# Altium schematic sheet LCD.SchDoc
size A
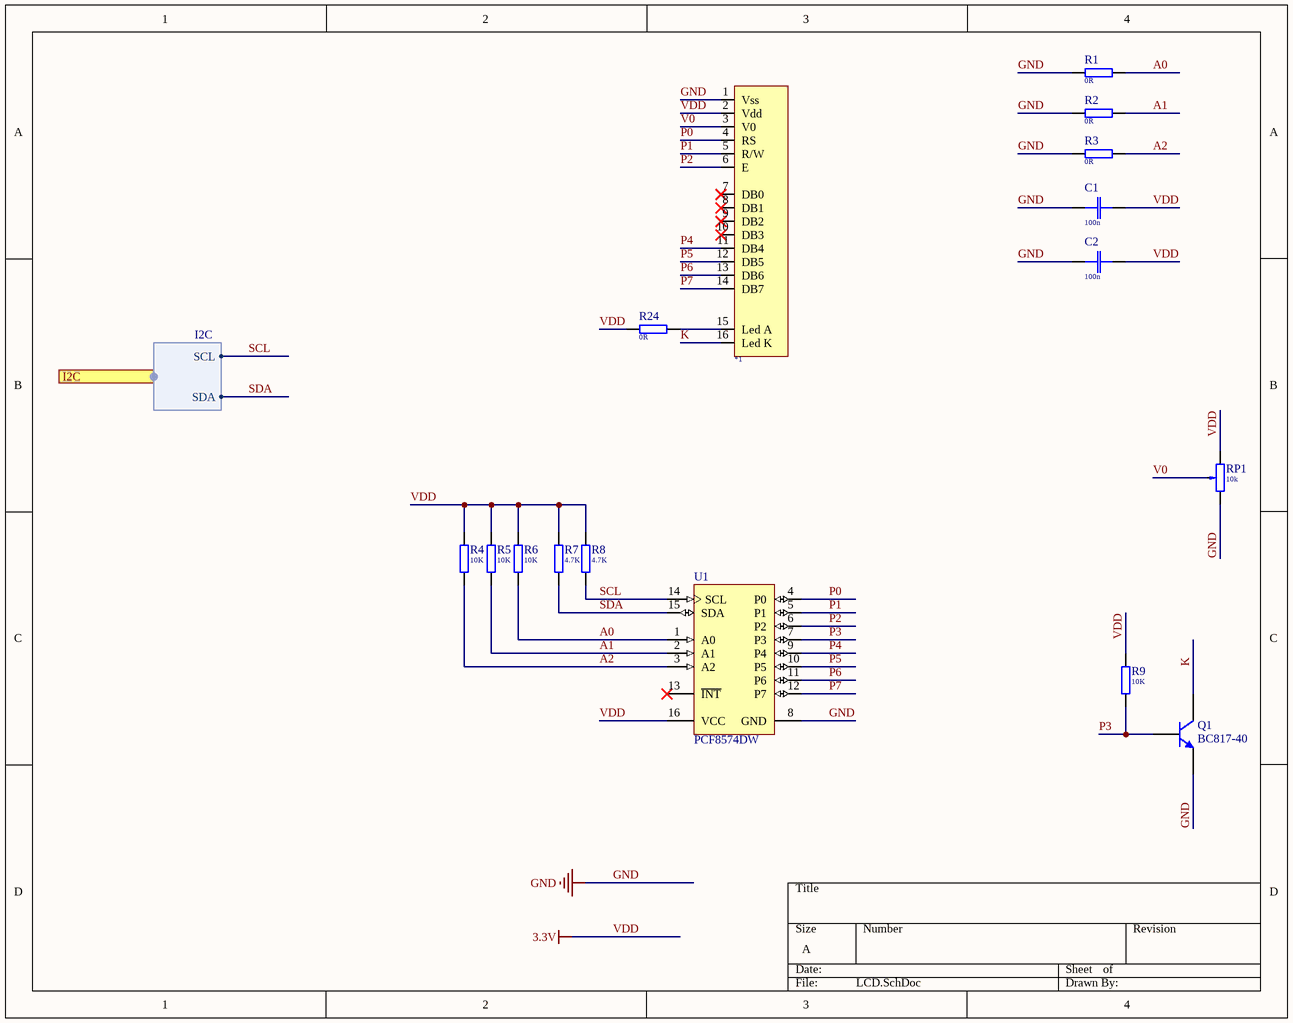
[diagram p0: LCD.SchDoc]

## Parts
*1  AC162B 2x16  [AC-162B 2x16]  (value not drawn)
C1  100n  [C0805(2013)]
C2  100n  [C0805(2013)]
Q1  BC817-40  [SOT23_N]
R1  0R  [R0805]
R2  0R  [R0805]
R3  0R  [R0805]
R4  10K  [R0805]
R5  10K  [R0805]
R6  10K  [R0805]
R7  4.7K  [R0805]
R8  4.7K  [R0805]
R9  10K  [R0805]
R24  0R  [R0805]
RP1  10k  [R-Tr 3362P]
U1  PCF8574DW  [DW16_N]

## Ports
I2C (harness I2C)

## Harnesses
I2C: SCL, SDA

## Nets
GND: *1.1(Vss) C1.1 C2.1 Q1.2(E) R1.2 R2.2 R3.2 RP1.1 U1.8(GND)
VDD: *1.2(Vdd) C1.2 C2.2 R4.2 R5.2 R6.2 R7.2 R8.2 R9.2 R24.2 RP1.3 U1.16(VCC)  [also labelled 3.3V]
A0: R1.1 R6.1 U1.1(A0)
A1: R2.1 R5.1 U1.2(A1)
A2: R3.1 R4.1 U1.3(A2)
K: *1.16(Led_K) Q1.3(C)
P0: *1.4(RS) U1.4(P0)
P1: *1.5(R/W) U1.5(P1)
P2: *1.6(E) U1.6(P2)
P3: Q1.1(B) R9.1 U1.7(P3)
P4: *1.11(DB4) U1.9(P4)
P5: *1.12(DB5) U1.10(P5)
P6: *1.13(DB6) U1.11(P6)
P7: *1.14(DB7) U1.12(P7)
SCL: R8.1 U1.14(SCL) ; port I2C.SCL
SDA: R7.1 U1.15(SDA) ; port I2C.SDA
V0: *1.3(V0) RP1.2
Net*1_15: *1.15(Led_A) R24.1

Not connected (* = marked no-connect by the designer): *1 7(DB0)* 8(DB1)* 9(DB2)* 10(DB3)*; U1 13(~{INT})*

## Library data of the parts
C1 C2 = C-0805   50V 100n: SMD-0805 50V Y5V +80/-20%; Price: 0.05; Value: 100n
Q1 = BC817-40: NPN General-purpose Transistor; Published: 17-Sep-2003; LatestRevisionDate: 12-Dec-2006; LatestRevisionNote: IPC-7351 Footprint Added.; DatasheetVersion: Jun-1999; PackageVersion: May-1999; PackageReference: SOT23; Publisher: Altium Limited; PackageDescription: 3-Pin SOT-23 Package 0.95 mm Pitch, 2.3 mm Lead Span; ComponentLink1Description: Manufacturer Link; ComponentLink1URL: http://www.semiconductors.philips.com/; ComponentLink2Description: Datasheet; ComponentLink2URL: http://www.semiconductors.philips.com/acrobat/datasheets/BC817_BC817W_BC337_5.pdf
R1-R9 R24 = R-0805: SMD 0805 0.1W 5% 150V; Price: 0.017
  R1-R3 R24: Value: 0R
  R4-R6 R9: Value: 10K
  R7 R8: Value: 4.7K
RP1 = R-Tr 3362F: Bourns 3362F 0.5W; Set Position: 0.5; Price: 0.2; Value: 10k
U1 = PCF8574DW: Remote 8-Bit I/O Expander for I2C-Bus, 2.5 to 6 V, -40 to 85 degC, 16-pin SOIC (DW), Green (RoHS & no Sb/Br); Manufacturer: Texas Instruments; SubFamily: I2C IO Expander; Voltage Nodes(V): 5, 3.3; Interrupt Output: Yes; fSCLK(Max)(MHz): 0.1; VCC(Min)(V): 2.5; VCC(Max)(V): 6; Max Frequency(kHz): 100; I2C Address: 0100 xxx; # of I/Os: 8; Vcc range(V): 2.5 to 6.0; DatasheetVersion: SCPS068G; PackageVersion: revG, Jan-2011; PackageReference: DW16; PackageDescription: 16-Pin Small Outline Integrated Circuit, 10.3 x 7.5 mm, Pitch 1.27 mm Pitch; Supplier 1: Digi-Key; Supplier Part Number 1: 296-26294-5-ND; Supplier 2: Newark; Supplier Part Number 2: 75C5236; Supplier 3: Mouser; Supplier Part Number 3: 595-PCF8574DW; Eco-Plan: Green (RoHS & no Sb/Br); Reset Input: No; Push-Pull I/O Type: Yes; Mounting Technology: Surface Mount; PartNumber: PCF8574DW; Code_JEDEC: MS-013-AA; ComponentLink1Description: Datasheet; ComponentLink1URL: http://www.ti.com/general/docs/lit/getliterature.tsp?genericPartNumber=PCF8574&fileType=pdf; ComponentLink2Description: Package Specification; ComponentLink2URL: http://www.ti.com/litv/pdf/msoi003g